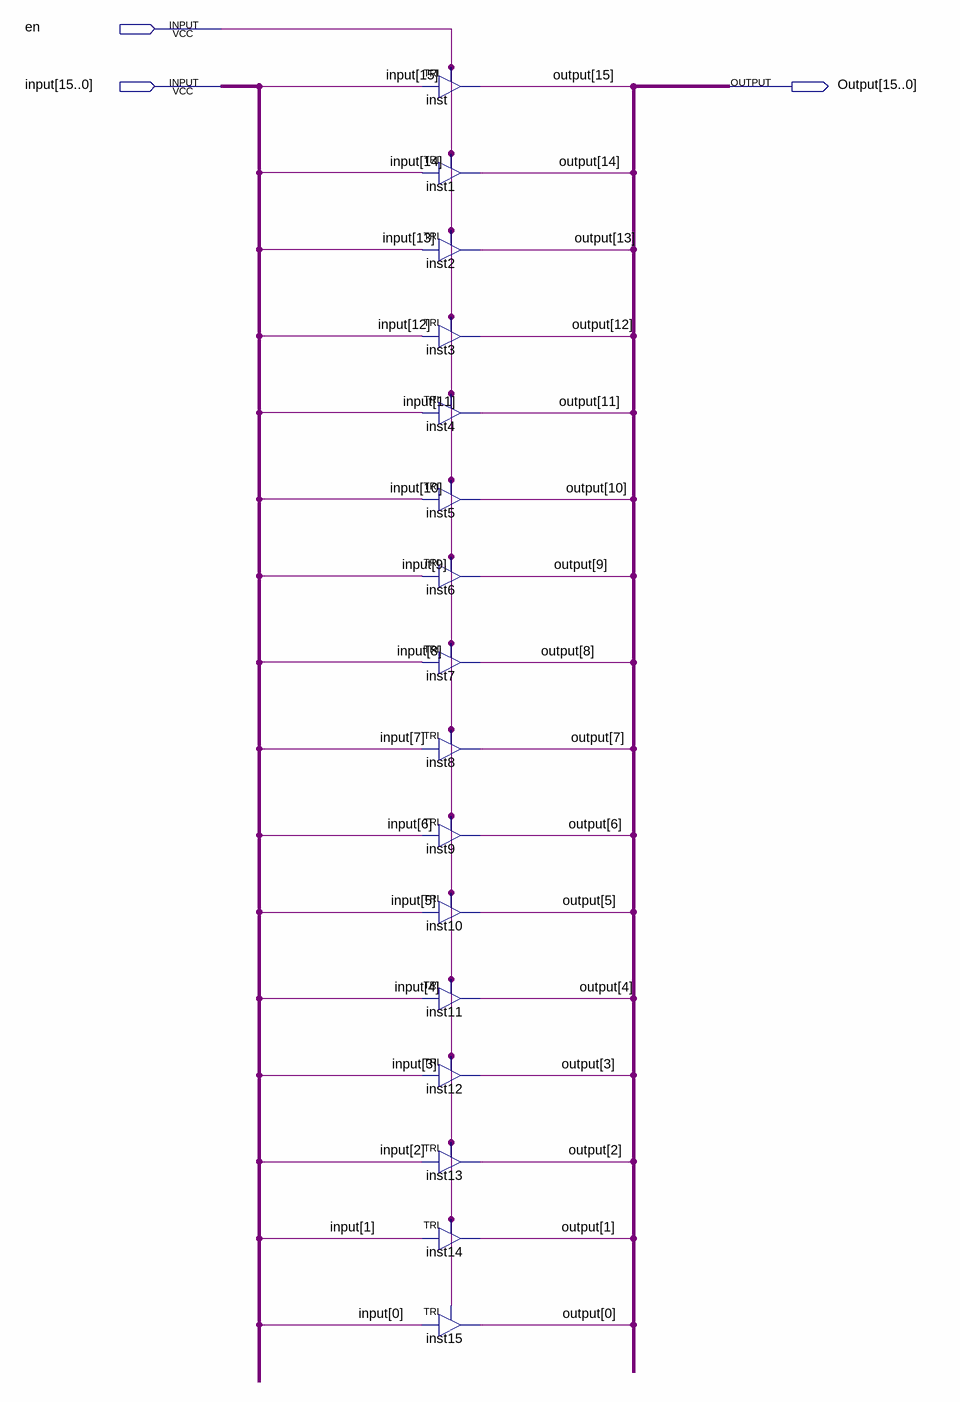
[diagram p0: schematic sheet]
// Quartus schematic 16Bit_Tri.bdf as structural Verilog: 16 symbols, 3 pins
module \16Bit_Tri  (
  input  en,
  input  [15:0] \input ,
  output [15:0] Output
);

  TRI inst (.IN(\input [15]), .OE(en), .OUT(Output[15]));
  TRI inst1 (.IN(\input [14]), .OE(en), .OUT(Output[14]));
  TRI inst2 (.IN(\input [13]), .OE(en), .OUT(Output[13]));
  TRI inst3 (.IN(\input [12]), .OE(en), .OUT(Output[12]));
  TRI inst4 (.IN(\input [11]), .OE(en), .OUT(Output[11]));
  TRI inst5 (.IN(\input [10]), .OE(en), .OUT(Output[10]));
  TRI inst6 (.IN(\input [9]), .OE(en), .OUT(Output[9]));
  TRI inst7 (.IN(\input [8]), .OE(en), .OUT(Output[8]));
  TRI inst8 (.IN(\input [7]), .OE(en), .OUT(Output[7]));
  TRI inst9 (.IN(\input [6]), .OE(en), .OUT(Output[6]));
  TRI inst10 (.IN(\input [5]), .OE(en), .OUT(Output[5]));
  TRI inst11 (.IN(\input [4]), .OE(en), .OUT(Output[4]));
  TRI inst12 (.IN(\input [3]), .OE(en), .OUT(Output[3]));
  TRI inst13 (.IN(\input [2]), .OE(en), .OUT(Output[2]));
  TRI inst14 (.IN(\input [1]), .OE(en), .OUT(Output[1]));
  TRI inst15 (.IN(\input [0]), .OE(en), .OUT(Output[0]));
endmodule
